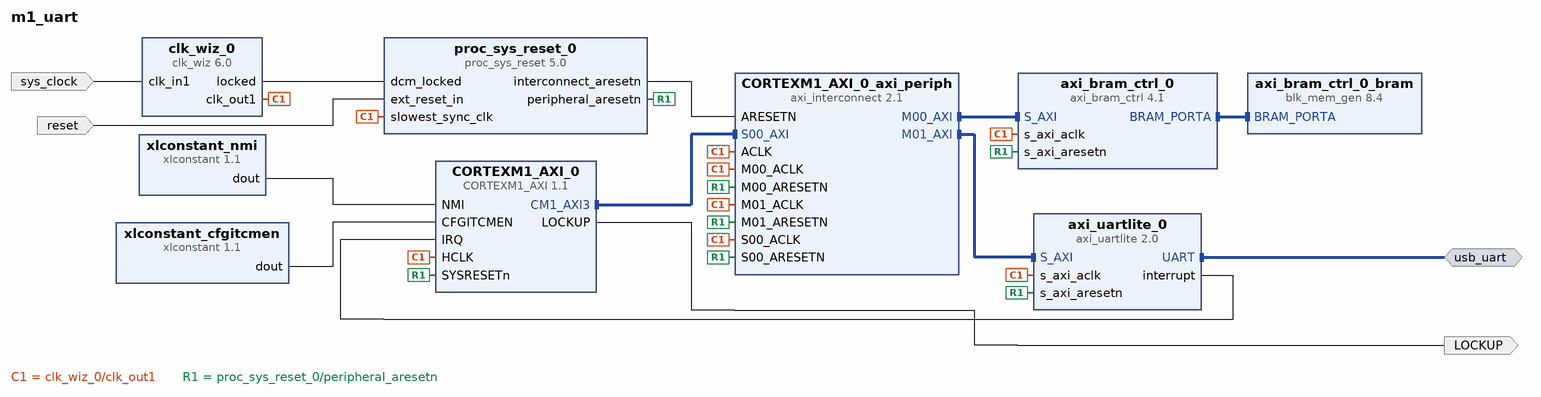
[diagram p0: block diagram of the top level]
# Vivado block design m1_uart, xc7a100tcsg324-1, Vivado 2020.2.2
create_bd_design m1_uart

create_bd_intf_port -mode Master -vlnv xilinx.com:interface:uart_rtl:1.0 usb_uart
create_bd_port -dir I -type rst reset
set_property -dict {CONFIG.POLARITY ACTIVE_LOW} [get_bd_ports reset]
create_bd_port -dir I -type clk sys_clock
set_property -dict {CONFIG.FREQ_HZ 100000000 CONFIG.PHASE 0.000} [get_bd_ports sys_clock]
create_bd_port -dir O LOCKUP

create_bd_cell -type ip -vlnv arm.com:CortexM:CORTEXM1_AXI:1.1 CORTEXM1_AXI_0
set_property -dict {CONFIG.DEBUG_SEL 3 CONFIG.DTCM_SIZE {"0111"} CONFIG.ITCM_SIZE {"0100"}} [get_bd_cells CORTEXM1_AXI_0]
create_bd_cell -type ip -vlnv xilinx.com:ip:axi_uartlite:2.0 axi_uartlite_0
set_property -dict [list \
  CONFIG.C_BAUDRATE 230400 \
  CONFIG.UARTLITE_BOARD_INTERFACE usb_uart \
  CONFIG.USE_BOARD_FLOW true \
] [get_bd_cells axi_uartlite_0]
create_bd_cell -type ip -vlnv xilinx.com:ip:proc_sys_reset:5.0 proc_sys_reset_0
set_property -dict {CONFIG.RESET_BOARD_INTERFACE reset CONFIG.USE_BOARD_FLOW true} [get_bd_cells proc_sys_reset_0]
create_bd_cell -type ip -vlnv xilinx.com:ip:clk_wiz:6.0 clk_wiz_0
set_property -dict [list \
  CONFIG.CLK_IN1_BOARD_INTERFACE sys_clock \
  CONFIG.RESET_BOARD_INTERFACE reset \
  CONFIG.USE_BOARD_FLOW true \
  CONFIG.USE_RESET false \
] [get_bd_cells clk_wiz_0]
create_bd_cell -type ip -vlnv xilinx.com:ip:xlconstant:1.1 xlconstant_nmi
set_property -dict {CONFIG.CONST_VAL 0} [get_bd_cells xlconstant_nmi]
create_bd_cell -type ip -vlnv xilinx.com:ip:xlconstant:1.1 xlconstant_cfgitcmen
set_property -dict {CONFIG.CONST_VAL 0 CONFIG.CONST_WIDTH 2} [get_bd_cells xlconstant_cfgitcmen]
create_bd_cell -type ip -vlnv xilinx.com:ip:axi_interconnect:2.1 CORTEXM1_AXI_0_axi_periph
set_property -dict {CONFIG.NUM_MI 2} [get_bd_cells CORTEXM1_AXI_0_axi_periph]
create_bd_cell -type ip -vlnv xilinx.com:ip:axi_bram_ctrl:4.1 axi_bram_ctrl_0
set_property -dict {CONFIG.SINGLE_PORT_BRAM 1} [get_bd_cells axi_bram_ctrl_0]
create_bd_cell -type ip -vlnv xilinx.com:ip:blk_mem_gen:8.4 axi_bram_ctrl_0_bram
set_property -dict {CONFIG.EN_SAFETY_CKT false} [get_bd_cells axi_bram_ctrl_0_bram]

# ---- connections ----

connect_bd_intf_net [get_bd_intf_pins CORTEXM1_AXI_0/CM1_AXI3] [get_bd_intf_pins CORTEXM1_AXI_0_axi_periph/S00_AXI]
connect_bd_intf_net [get_bd_intf_pins axi_bram_ctrl_0/S_AXI] [get_bd_intf_pins CORTEXM1_AXI_0_axi_periph/M00_AXI]
connect_bd_intf_net [get_bd_intf_pins axi_uartlite_0/S_AXI] [get_bd_intf_pins CORTEXM1_AXI_0_axi_periph/M01_AXI]
connect_bd_intf_net [get_bd_intf_pins axi_bram_ctrl_0_bram/BRAM_PORTA] [get_bd_intf_pins axi_bram_ctrl_0/BRAM_PORTA]
connect_bd_intf_net [get_bd_intf_ports usb_uart] [get_bd_intf_pins axi_uartlite_0/UART]
connect_bd_net [get_bd_ports reset] [get_bd_pins proc_sys_reset_0/ext_reset_in]
connect_bd_net [get_bd_ports sys_clock] [get_bd_pins clk_wiz_0/clk_in1]
connect_bd_net [get_bd_pins clk_wiz_0/locked] [get_bd_pins proc_sys_reset_0/dcm_locked]
connect_bd_net [get_bd_pins clk_wiz_0/clk_out1] \
  [get_bd_pins proc_sys_reset_0/slowest_sync_clk] [get_bd_pins CORTEXM1_AXI_0/HCLK] \
  [get_bd_pins CORTEXM1_AXI_0_axi_periph/S00_ACLK] [get_bd_pins axi_uartlite_0/s_axi_aclk] \
  [get_bd_pins CORTEXM1_AXI_0_axi_periph/ACLK] [get_bd_pins CORTEXM1_AXI_0_axi_periph/M00_ACLK] \
  [get_bd_pins axi_bram_ctrl_0/s_axi_aclk] [get_bd_pins CORTEXM1_AXI_0_axi_periph/M01_ACLK]
connect_bd_net [get_bd_pins proc_sys_reset_0/peripheral_aresetn] \
  [get_bd_pins axi_uartlite_0/s_axi_aresetn] [get_bd_pins CORTEXM1_AXI_0/SYSRESETn] \
  [get_bd_pins CORTEXM1_AXI_0_axi_periph/S00_ARESETN] [get_bd_pins CORTEXM1_AXI_0_axi_periph/M00_ARESETN] \
  [get_bd_pins axi_bram_ctrl_0/s_axi_aresetn] [get_bd_pins CORTEXM1_AXI_0_axi_periph/M01_ARESETN]
connect_bd_net [get_bd_pins axi_uartlite_0/interrupt] [get_bd_pins CORTEXM1_AXI_0/IRQ]
connect_bd_net [get_bd_pins xlconstant_nmi/dout] [get_bd_pins CORTEXM1_AXI_0/NMI]
connect_bd_net [get_bd_pins xlconstant_cfgitcmen/dout] [get_bd_pins CORTEXM1_AXI_0/CFGITCMEN]
connect_bd_net [get_bd_pins CORTEXM1_AXI_0/LOCKUP] [get_bd_ports LOCKUP]
connect_bd_net -net ARESETN_1 [get_bd_pins proc_sys_reset_0/interconnect_aresetn] [get_bd_pins CORTEXM1_AXI_0_axi_periph/ARESETN]

# ---- address map ----
assign_bd_address -offset 0x00000000 -range 128K -target_address_space [get_bd_addr_spaces CORTEXM1_AXI_0/CM1_AXI3] [get_bd_addr_segs axi_bram_ctrl_0/S_AXI/Mem0]
assign_bd_address -offset 0x40600000 -range 64K -target_address_space [get_bd_addr_spaces CORTEXM1_AXI_0/CM1_AXI3] [get_bd_addr_segs axi_uartlite_0/S_AXI/Reg]

validate_bd_design
save_bd_design
